# Altium schematic sheet subckt_RF2,3_filter_bank.SchDoc: UP RF2,3 filter bank
size A3; DocumentNumber: 15; Revision: 0; SheetNumber: 15; SheetTotal: 19
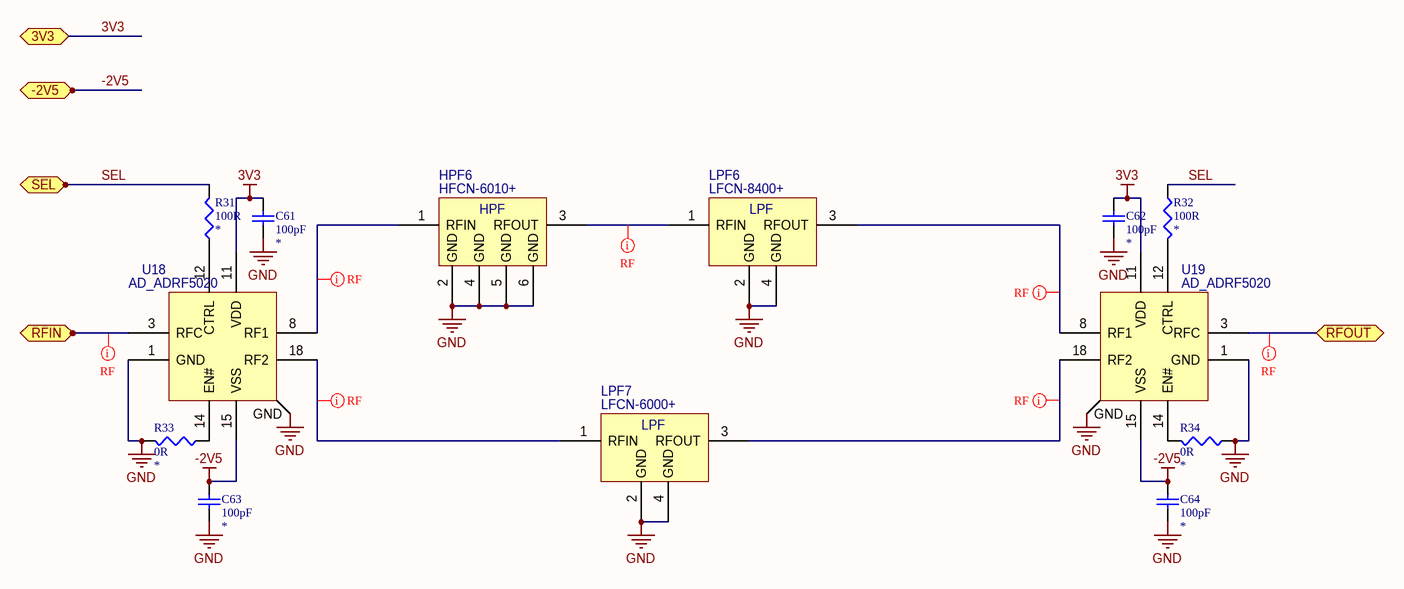
[diagram p0: subckt_RF2,3_filter_bank.SchDoc]

## Parts
C61  value 100pF  [TBD]  (hidden comment: Capacitor)
C62  value 100pF  [TBD]  (hidden comment: Capacitor)
C63  value 100pF  [TBD]  (hidden comment: Capacitor)
C64  value 100pF  [TBD]  (hidden comment: Capacitor)
HPF6  HFCN-6010+
LPF6  LFCN-8400+
LPF7  LFCN-6000+
R31  value 100R  [RES0603]  (hidden comment: Resistor)
R32  value 100R  [RES0603]  (hidden comment: Resistor)
R33  value 0R  [RES0603]  (hidden comment: Resistor)
R34  value 0R  [RES0603]  (hidden comment: Resistor)
U18  AD_ADRF5020
U19  AD_ADRF5020

## Ports
3V3, -2V5, RFIN, RFOUT, SEL

## Nets
3V3: C61.2 C62.2 U18.11(VDD) U19.11(VDD) ; port 3V3
-2V5: C63.2 C64.2 U18.15(VSS) U19.15(VSS) ; port -2V5
GND: C61.1 C62.1 C63.1 C64.1 HPF6.2(GND) HPF6.4(GND) HPF6.5(GND) HPF6.6(GND) LPF6.2(GND) LPF6.4(GND) LPF7.2(GND) LPF7.4(GND) R33.2 R34.2 U18.1(GND) U18.2(GND) U18.4(GND) U18.5(GND) U18.6(GND) U18.7(GND) U18.9(GND) U18.10(GND) U18.13(GND) U18.16(GND) U18.17(GND) U18.19(GND) U18.20(GND) U18.21(GND) U19.1(GND) U19.2(GND) U19.4(GND) U19.5(GND) U19.6(GND) U19.7(GND) U19.9(GND) U19.10(GND) U19.13(GND) U19.16(GND) U19.17(GND) U19.19(GND) U19.20(GND) U19.21(GND)
RFIN: U18.3(RFC) ; port RFIN
RFOUT: U19.3(RFC) ; port RFOUT
SEL: R31.2 R32.2 ; port SEL
NetHPF6_1: HPF6.1(RFIN) U18.8(RF1)
NetHPF6_3: HPF6.3(RFOUT) LPF6.1(RFIN)
NetLPF6_3: LPF6.3(RFOUT) U19.8(RF1)
NetLPF7_1: LPF7.1(RFIN) U18.18(RF2)
NetLPF7_3: LPF7.3(RFOUT) U19.18(RF2)
NetR31_1: R31.1 U18.12(CTRL)
NetR32_1: R32.1 U19.12(CTRL)
NetR33_1: R33.1 U18.14(EN#)
NetR34_1: R34.1 U19.14(EN#)

## Layout directives
net class RF: NetHPF6_1, NetHPF6_3, NetLPF6_3, NetLPF7_1, NetLPF7_3, RFIN, RFOUT

## Notes on the sheet
- (in symbol minicircuits_HFCN-6010+) HPF
- (in symbol minicircuits_LFCN-6000+) LPF
- (in symbol minicircuits_LFCN-8400+) LPF

## Library data of the parts
HPF6 = minicircuits_HFCN-6010+: HPF 6.3GHz-15GHz
LPF6 = minicircuits_LFCN-8400+: LPF 8400MHz
LPF7 = minicircuits_LFCN-6000+: LPF 6000MHz
U18 U19 = AD_ADRF5020: AD SPDT Switch, 100MHz-30GHz
C61-C64 = Capacitor: Dielectric: *
R31-R34 = Resistor: Type: *